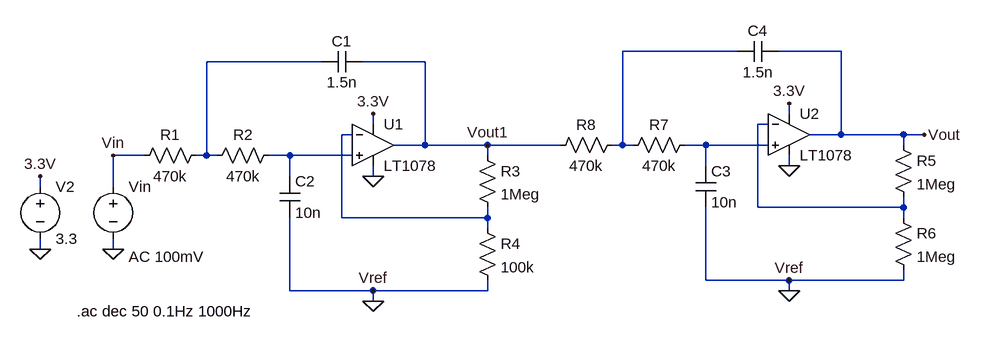
[diagram p0: schematic 100Hz_LPF.asc]
100Hz_LPF.asc, the LTspice schematic file:
Version 4
SHEET 1 1288 680
WIRE 768 16 592 16
WIRE 928 16 832 16
WIRE 128 32 -48 32
WIRE 288 32 192 32
WIRE 848 112 848 96
WIRE 208 128 208 112
WIRE 816 128 800 128
WIRE 176 144 160 144
WIRE 928 144 928 16
WIRE 928 144 880 144
WIRE 1024 144 928 144
WIRE 1056 144 1024 144
WIRE 288 160 288 32
WIRE 288 160 240 160
WIRE 384 160 288 160
WIRE 496 160 384 160
WIRE 592 160 592 16
WIRE 592 160 576 160
WIRE 608 160 592 160
WIRE 720 160 688 160
WIRE 816 160 720 160
WIRE 1024 160 1024 144
WIRE -144 176 -192 176
WIRE -48 176 -48 32
WIRE -48 176 -64 176
WIRE -32 176 -48 176
WIRE 80 176 48 176
WIRE 176 176 80 176
WIRE 384 176 384 160
WIRE 720 192 720 160
WIRE 848 192 848 176
WIRE 80 208 80 176
WIRE 208 208 208 192
WIRE -304 224 -304 208
WIRE -192 224 -192 176
WIRE 800 256 800 128
WIRE 1024 256 1024 240
WIRE 1024 256 800 256
WIRE 160 272 160 144
WIRE 384 272 384 256
WIRE 384 272 160 272
WIRE 1024 272 1024 256
WIRE 384 288 384 272
WIRE -304 320 -304 304
WIRE -192 320 -192 304
WIRE 720 368 720 256
WIRE 848 368 720 368
WIRE 1024 368 1024 352
WIRE 1024 368 848 368
WIRE 80 384 80 272
WIRE 208 384 80 384
WIRE 384 384 384 368
WIRE 384 384 208 384
WIRE 848 384 848 368
WIRE 208 400 208 384
FLAG 208 208 0
FLAG 208 400 0
FLAG -192 320 0
FLAG -304 320 0
FLAG 208 112 3.3V
FLAG -304 208 3.3V
FLAG -192 176 Vin
FLAG 208 384 Vref
FLAG 848 192 0
FLAG 848 384 0
FLAG 848 96 3.3V
FLAG 1056 144 Vout
FLAG 848 368 Vref
FLAG 384 160 Vout1
SYMBOL OpAmps\\LT1078 208 96 R0
SYMATTR InstName U1
SYMBOL cap 64 208 R0
SYMATTR InstName C2
SYMATTR Value 10n
SYMBOL cap 128 48 R270
WINDOW 0 32 32 VTop 2
WINDOW 3 0 32 VBottom 2
SYMATTR InstName C1
SYMATTR Value 1.5n
SYMBOL res 368 160 R0
SYMATTR InstName R3
SYMATTR Value 1Meg
SYMBOL res 368 272 R0
SYMATTR InstName R4
SYMATTR Value 100k
SYMBOL res -48 192 R270
WINDOW 0 32 56 VTop 2
WINDOW 3 0 56 VBottom 2
SYMATTR InstName R2
SYMATTR Value 470k
SYMBOL res -160 192 R270
WINDOW 0 32 56 VTop 2
WINDOW 3 0 56 VBottom 2
SYMATTR InstName R1
SYMATTR Value 470k
SYMBOL voltage -192 208 R0
WINDOW 123 24 124 Left 2
WINDOW 39 0 0 Left 0
SYMATTR Value2 AC 100mV
SYMATTR InstName Vin
SYMATTR Value ""
SYMBOL voltage -304 208 R0
WINDOW 123 0 0 Left 0
WINDOW 39 0 0 Left 0
SYMATTR InstName V2
SYMATTR Value 3.3
SYMBOL OpAmps\\LT1078 848 80 R0
SYMATTR InstName U2
SYMBOL cap 704 192 R0
SYMATTR InstName C3
SYMATTR Value 10n
SYMBOL cap 768 32 R270
WINDOW 0 32 32 VTop 2
WINDOW 3 0 32 VBottom 2
SYMATTR InstName C4
SYMATTR Value 1.5n
SYMBOL res 1008 144 R0
SYMATTR InstName R5
SYMATTR Value 1Meg
SYMBOL res 1008 256 R0
SYMATTR InstName R6
SYMATTR Value 1Meg
SYMBOL res 592 176 R270
WINDOW 0 32 56 VTop 2
WINDOW 3 0 56 VBottom 2
SYMATTR InstName R7
SYMATTR Value 470k
SYMBOL res 480 176 R270
WINDOW 0 32 56 VTop 2
WINDOW 3 0 56 VBottom 2
SYMATTR InstName R8
SYMATTR Value 470k
TEXT -248 416 Left 2 !.ac dec 50 0.1Hz 1000Hz

The netlist it stands for:
* 100Hz_LPF.asc
XU1 N006 N004 3.3V 0 Vout1 LT1078  ; pins In+ In- V+ V- OUT
C2 N006 0 10n
C1 N002 Vout1 1.5n
R3 Vout1 N004 1Meg
R4 N004 0 100k
R2 N002 N006 470k
R1 Vin N002 470k
Vin Vin 0 AC 100mV
V2 3.3V 0 3.3
XU2 N005 N003 3.3V 0 Vout LT1078  ; pins In+ In- V+ V- OUT
C3 N005 0 10n
C4 N001 Vout 1.5n
R5 Vout N003 1Meg
R6 N003 0 1Meg
R7 N001 N005 470k
R8 Vout1 N001 470k
.ac dec 50 0.1Hz 1000Hz
.backanno
.end